# EasyEDA schematic SCH_new rfid esp + arduino_2022-06-15.json
TITLE: Sheet_1; REV: 1.0; Date: 2022-06-12; Sheet: 1/1; Drawn By: kaka_tv; Company: Your Company
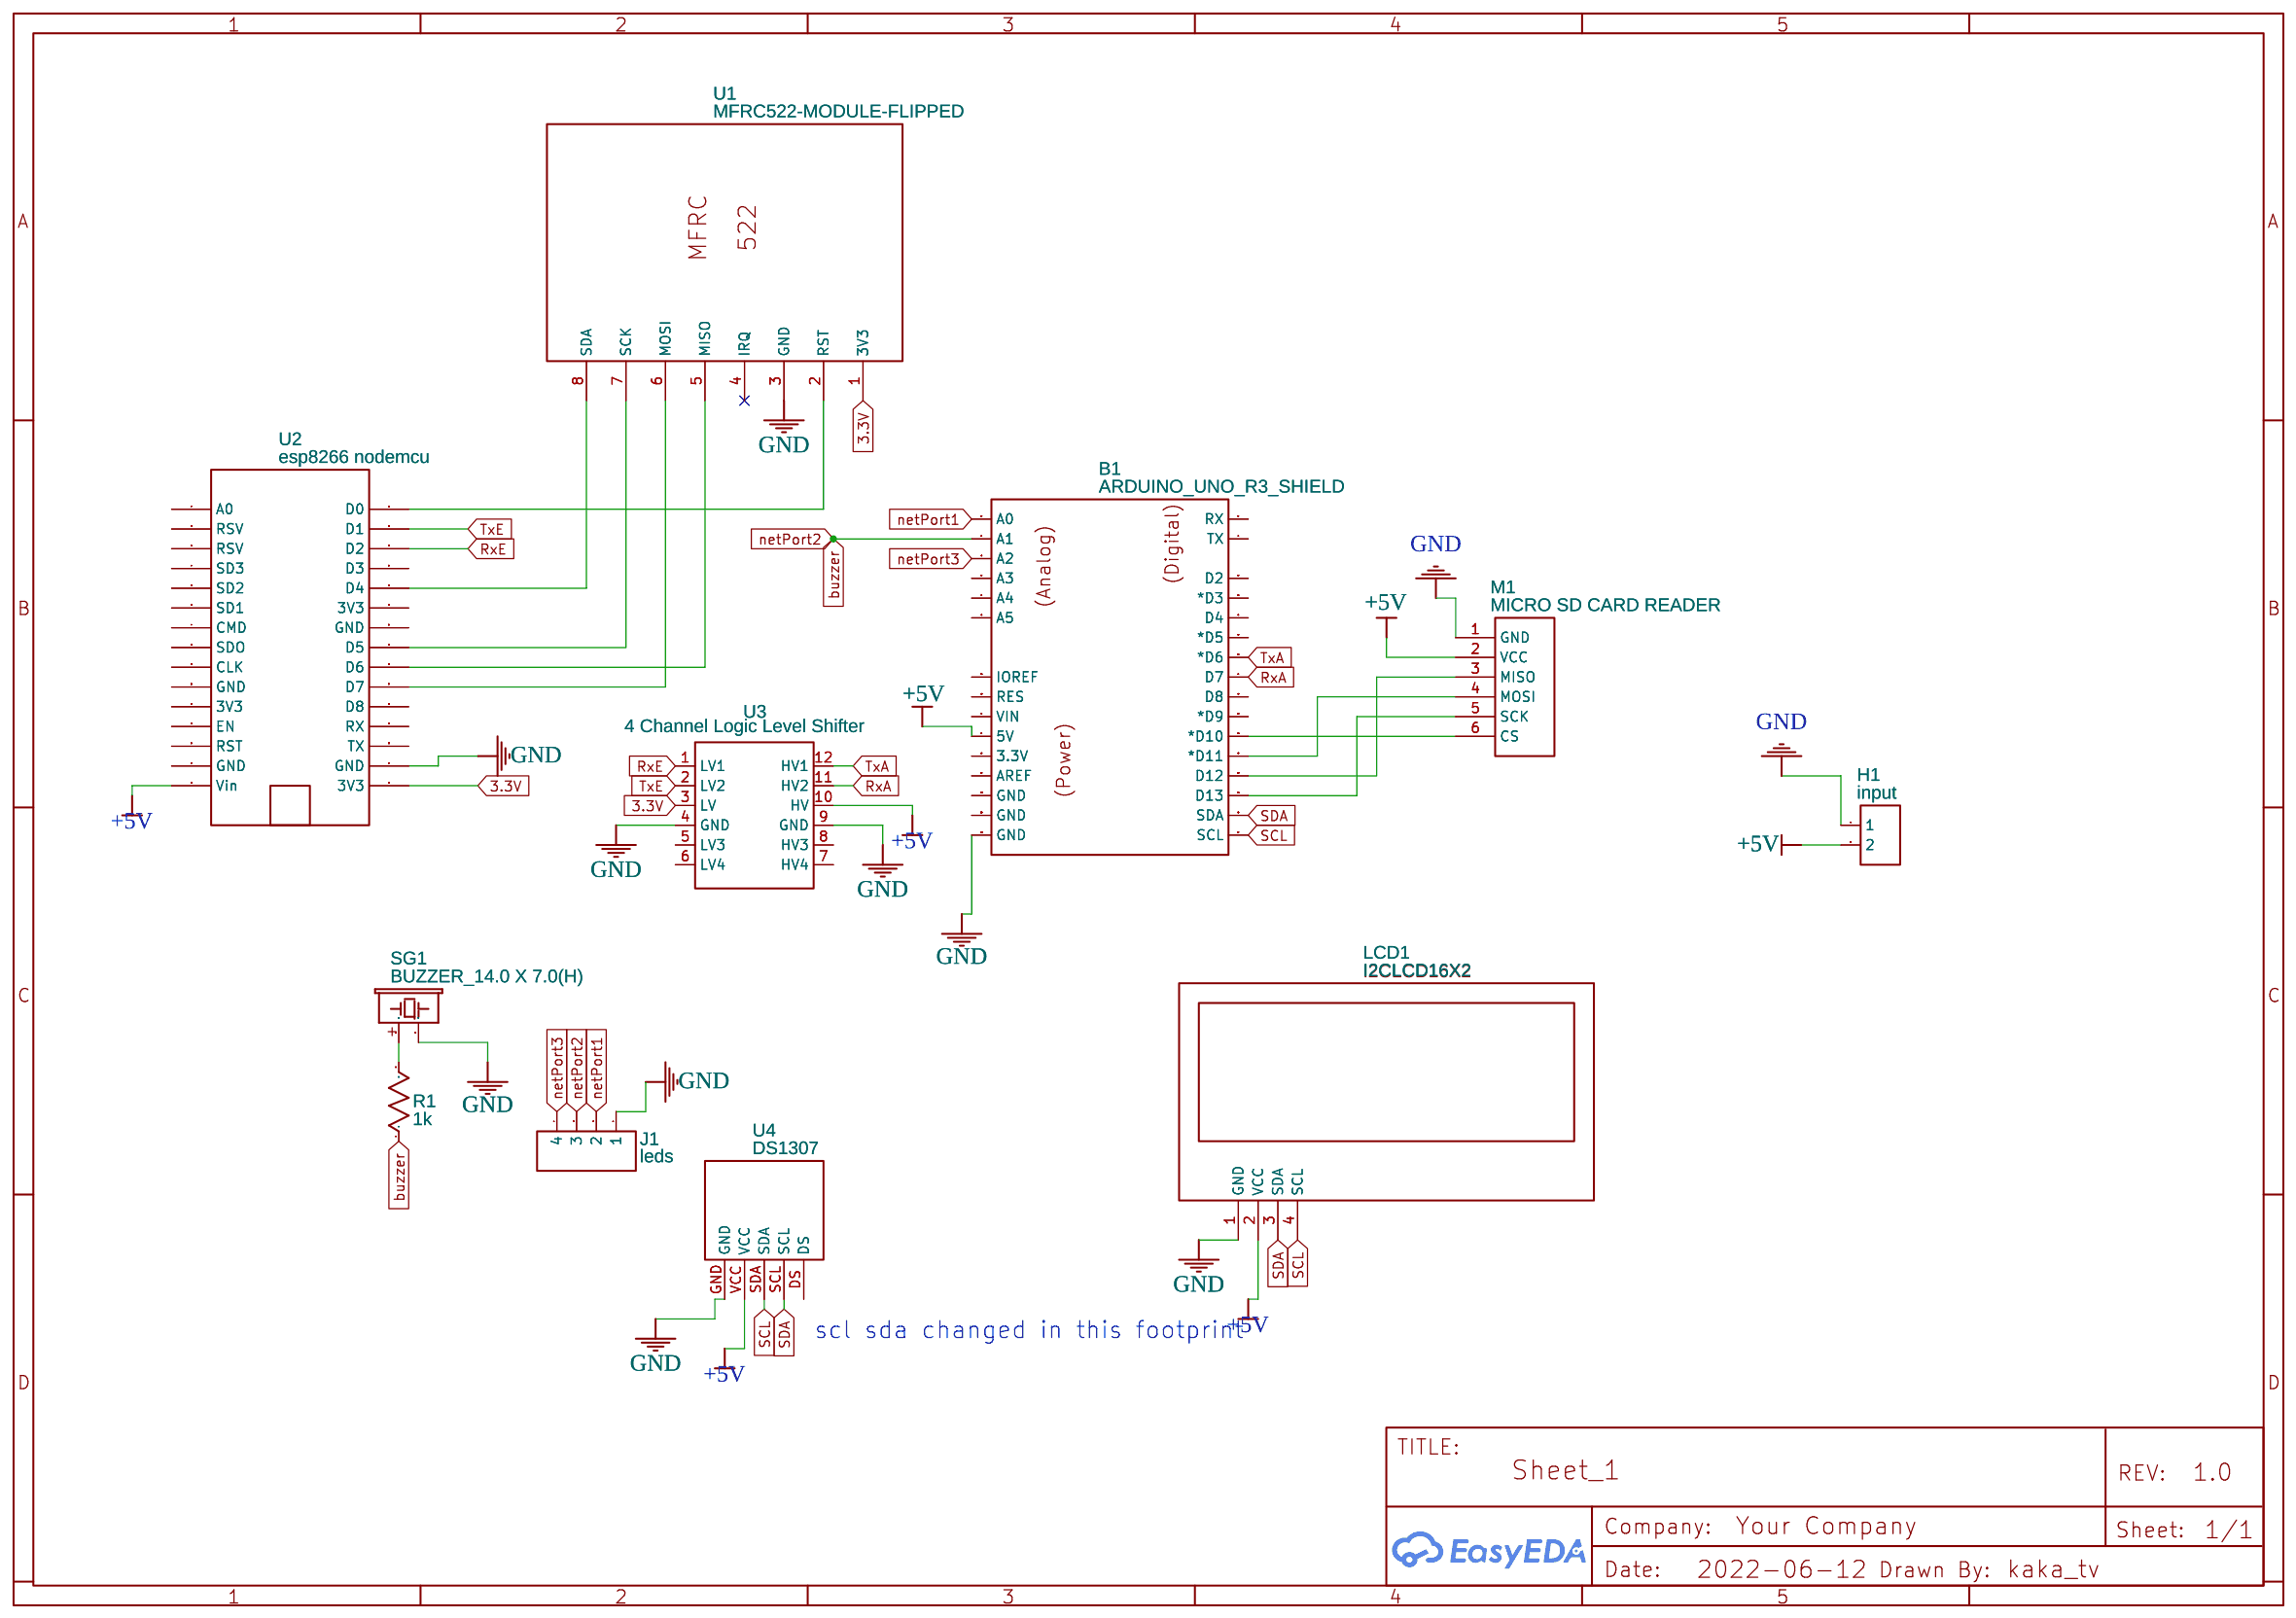
[diagram p0: schematic sheet]

## Parts
B1  ARDUINO_UNO_R3_SHIELD  [PKG-ARDUINO-UNO-R3-SHIELD]
H1  input  [HDR-F-2.54_1X2]
J1  leds  [HDR-M-2.54_1X4]
LCD1  I2CLCD16X2  [I2CLCD16X2]
M1  MICRO SD CARD READER  [MICRO_SD_CARD_READER]
R1  1k  [R_AXIAL-0.3]
SG1  BUZZER_14.0 X 7.0(H)  [BUZZER-14MM]
U1  MFRC522-MODULE-FLIPPED  [MFRC522-MODULE-FLIPPED]
U2  esp8266 nodemcu  [ESP8266NODEMCU]
U3  4 Channel Logic Level Shifter  [4 CHANNEL LOGIC LEVEL SHIFTER]
U4  DS1307  [DS1307]

## Library data of the parts
B1 = ARDUINO_UNO_R3_SHIELD: Manufacturer: ?; Manufacturer Part: ?; Link: ?; Contributor: Bondok82xDDD
H1 = HDR-F-2.54_1x2: Supplier Part: C49661; Supplier: LCSC; Contributor: LCEDA_Lib
J1 = HDR-M-2.54_1x4: Supplier Part: C124378; Supplier: LCSC; Contributor: LCEDA_Lib
LCD1 = I2CLCD16X2: Contributor: hobbyelectronix
M1 = MICRO SD CARD READER: sourceId: PKkG2MKHF; Supplier: Mouser; Contributor: kek1655
R1 = R_AXIAL-0.3_US: Contributor: LCEDA_Lib
SG1 = BUZZER_14.0 X 7.0(H): Contributor: Вячеслав Корнев
U1 = MFRC522-MODULE-FLIPPED: Contributor: flzurhorst
U2 = esp8266 nodemcu: Contributor: xxian9799
U3 = 4 Channel Logic Level Shifter
U4 = DS1307: Contributor: lufer2000

## Nets
3.3V: U1.1(3V3) U2.16(3V3) U3.3(LV)
+5V: B1.5V H1.2 LCD1.2(VCC) M1.2(VCC) U2.15(Vin) U3.10(HV) U4.VCC
GND: B1.GND@0(GND) H1.1 J1.1 LCD1.1(GND) M1.1(GND) SG1.2 U1.3(GND) U2.17(GND) U3.4(GND) U3.9(GND) U4.GND
buzzer: B1.A1 J1.3 R1.1
netPort1: B1.A0 J1.2
netPort3: B1.A2 J1.4
RxA: B1.D7 U3.11(HV2)
RxE: U2.28(D2) U3.1(LV1)
SCL: B1.SCL LCD1.4(SCL) U4.SDA
SDA: B1.SDA LCD1.3(SDA) U4.SCL
TxA: B1.D6(*D6) U3.12(HV1)
TxE: U2.29(D1) U3.2(LV2)
Net-(B1-D10): B1.D10(*D10) M1.6(CS)
Net-(B1-D11): B1.D11(*D11) M1.4(MOSI)
Net-(B1-D12): B1.D12 M1.3(MISO)
Net-(B1-D13): B1.D13 M1.5(SCK)
Net-(R1-2): R1.2 SG1.1
Net-(U1-2): U1.2(RST) U2.30(D0)
Net-(U1-5): U1.5(MISO) U2.22(D6)
Net-(U1-6): U1.6(MOSI) U2.21(D7)
Net-(U1-7): U1.7(SCK) U2.23(D5)
Net-(U1-8): U1.8(SDA) U2.26(D4)

Not connected (* = marked no-connect by the designer): B1 3.3V A3 A4 A5 AREF D2 D3(*D3) D4 D5(*D5) D8 D9(*D9) GND@1(GND) GND@2(GND) IOREF RES RX TX VIN; U1 4(IRQ)*; U2 1(A0) 2(RSV) 3(RSV) 4(SD3) 5(SD2) 6(SD1) 7(CMD) 8(SDO) 9(CLK) 10(GND) 11(3V3) 12(EN) 13(RST) 14(GND) 18(TX) 19(RX) 20(D8) 24(GND) 25(3V3) 27(D3); U3 5(LV3) 6(LV4) 7(HV4) 8(HV3); U4 DS

## Notes on the sheet
- scl sda changed in this footprint
